# EAGLE design Telex (EAGLE 9.3.0)
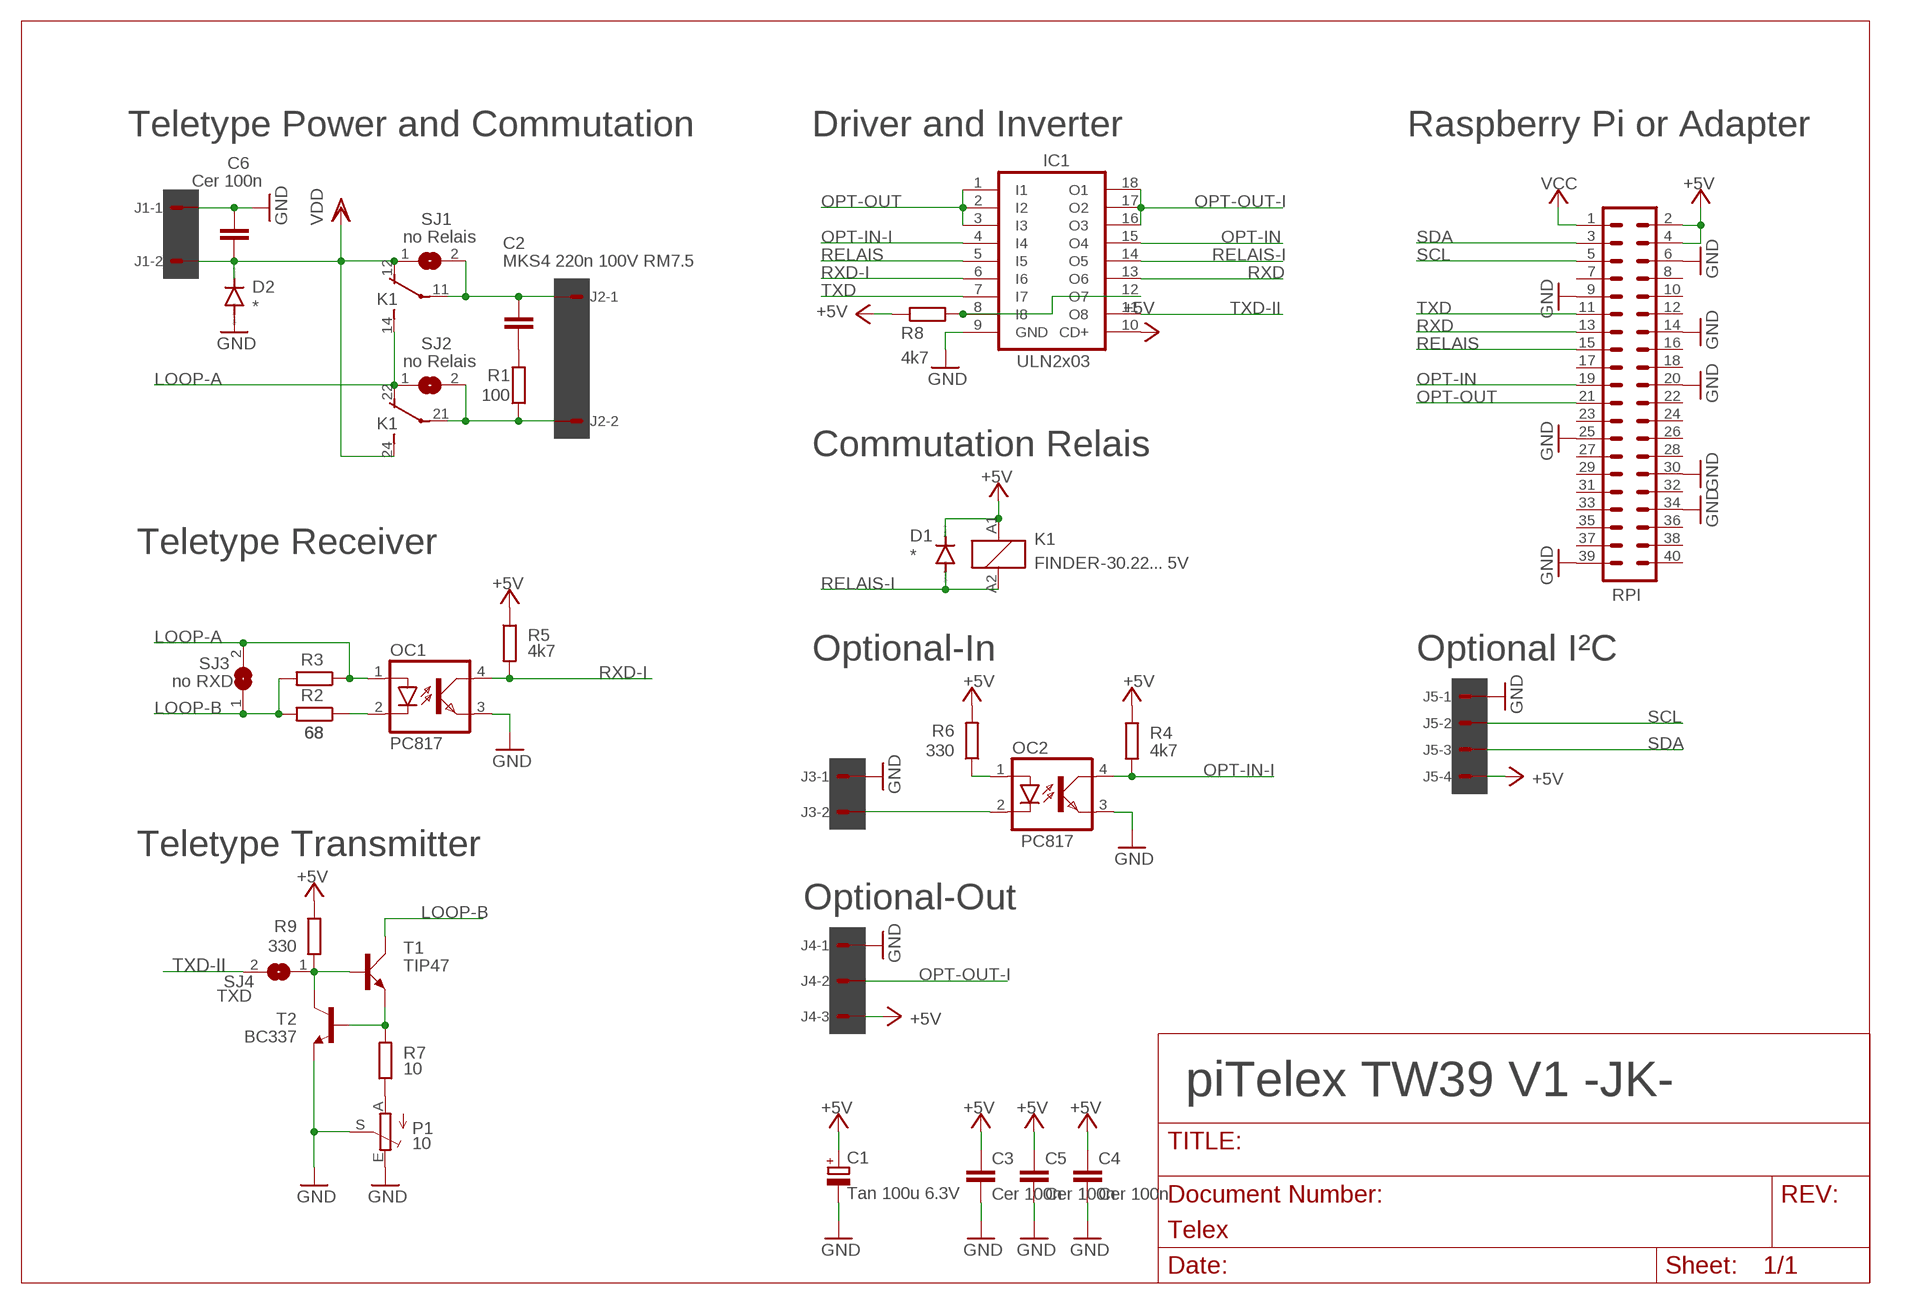
[diagram p0: schematic, sheet 1]

## Parts
C1  Tan 100u 6.3V  CPOL-EUE2.5-6  [E2,5-6]
C2  MKS4 220n 100V RM7.5  C-EU075-042X103  [C075-042X103]
C3  Cer 100n  C-EU050-024X044  [C050-024X044]
C4  Cer 100n  C-EU050-024X044  [C050-024X044]
C5  Cer 100n  C-EU050-024X044  [C050-024X044]
C6  Cer 100n  C-EU050-024X044  [C050-024X044]
D1  *  DIODE-MINIMELF  [MINIMELF]
D2  *  DIODE-MINIMELF  [MINIMELF]
IC1  ULN2x03  ULN2803A  [DIL18]
J1  22-27-2021-02  [6410-02]
J2  22-27-2021-02  [6410-02]
J3  22-27-2021-02  [6410-02]
J4  22-27-2031-03  [6410-03]
J5  22-27-2041-04  [6410-04]
K1  FINDER-30.22... 5V  FINDER-30.22  [FINDER-30.22]
OC1  PC817  [DIL04]
OC2  PC817  [DIL04]
P1  10  TRIM_EU-S64Y  [S64Y]
R1  100  R-EU_0204/7  [0204/7]
R2  68  R-EU_0204/7  [0204/7]
R3  68  R-EU_0204/7  [0204/7]
R4  4k7  R-EU_0204/7  [0204/7]
R5  4k7  R-EU_0204/7  [0204/7]
R6  330  R-EU_0204/7  [0204/7]
R7  10  R-EU_0204/7  [0204/7]
R8  4k7  R-EU_0204/7  [0204/7]
R9  330  R-EU_0204/7  [0204/7]
RPI  MA20-2  [MA20-2]
SJ1  no Relais  SJ  [SJ]
SJ2  no Relais  SJ  [SJ]
SJ3  no RXD  SJ  [SJ]
SJ4  TXD  SJ  [SJ]
T1  TIP47  TIP41C  [TO220AV]
T2  BC337  [TO92]

## Nets
+5V: C1.+ C3.1 C4.1 C5.1 D1.C IC1.10(CD+) J4.3 J5.4 K1.A1 R4.1 R5.1 R6.2 R8.1 R9.1 RPI.2 RPI.4
GND: C1.- C3.2 C4.2 C5.2 C6.2 D2.A IC1.9(GND) J1.1 J3.1 J4.1 J5.1 OC1.3(EMIT) OC2.3(EMIT) P1.E P1.S RPI.6 RPI.9 RPI.14 RPI.20 RPI.25 RPI.30 RPI.34 RPI.39 T2.1(E)
LOOP-A [60V]: K1.14(-1:S) K1.22(-2:O) OC1.1(A) R3.1 SJ2.1 SJ3.2
LOOP-B [60V]: R2.2 R3.2 SJ3.1 T1.C
N$1: C2.2 R1.2
N$2 [60V]: OC1.2(C) R2.1
N$3: OC2.1(A) R6.1
N$4 [60V]: C2.1 J2.1 K1.11(-1:P) SJ1.2
N$5: P1.A R7.1
N$6 [60V]: J2.2 K1.21(-2:P) R1.1 SJ2.2
N$10: J3.2 OC2.2(C)
N$11: R7.2 T1.E T2.2(B)
OPT-IN: IC1.15(O4) RPI.19
OPT-IN-I: IC1.4(I4) OC2.4(COL) R4.2
OPT-OUT: IC1.1(I1) IC1.2(I2) IC1.3(I3) RPI.21
OPT-OUT-I: IC1.16(O3) IC1.17(O2) IC1.18(O1) J4.2
RELAIS: IC1.5(I5) RPI.15
RELAIS-I: D1.A IC1.14(O5) K1.A2
RXD: IC1.13(O6) RPI.13
RXD-I: IC1.6(I6) OC1.4(COL) R5.2
SCL: J5.2 RPI.5
SDA: J5.3 RPI.3
TXD: IC1.7(I7) RPI.11
TXD-II: IC1.11(O8) SJ4.2
TXD-IIX: R9.2 SJ4.1 T1.B T2.3(C)
TXT-I: IC1.8(I8) IC1.12(O7) R8.2
VCC: RPI.1
VDD [60V]: C6.1 D2.C J1.2 K1.12(-1:O) K1.24(-2:S) SJ1.1
Unconnected: RPI.7 RPI.8 RPI.10 RPI.12 RPI.16 RPI.17 RPI.18 RPI.22 RPI.23 RPI.24 RPI.26 RPI.27 RPI.28 RPI.29 RPI.31 RPI.32 RPI.33 RPI.35 RPI.36 RPI.37 RPI.38 RPI.40

## Notes on the sheet
- Teletype Power and Commutation | Driver and Inverter | Raspberry Pi or Adapter
- Commutation Relais
- Teletype Receiver
- Optional-In | Optional I²C
- Teletype Transmitter
- Optional-Out
- piTelex TW39 V1 -JK-

## Library data of the parts
C1 = resistor:CPOL-EU: POLARIZED CAPACITOR, European symbol
C2-C6 = resistor:C-EU: CAPACITOR, European symbol
D1 D2 = diode:DIODE-: DIODE
IC1 = uln-udn:ULN2803A: DRIVER ARRAY
J1-J3 = con-molex:22-?-02: CONNECTOR wire to board 2.54 mm (.1 inch) pitch header; MF: MOLEX; OC_FARNELL: unknown; OC_NEWARK: unknown
J4 = con-molex:22-?-03: CONNECTOR wire to board 2.54 mm (.1 inch) pitch header; MF: MOLEX; OC_FARNELL: unknown; OC_NEWARK: unknown
J5 = con-molex:22-?-04: CONNECTOR wire to board 2.54 mm (.1 inch) pitch header; MF: MOLEX; OC_FARNELL: unknown; OC_NEWARK: unknown
K1 = relay:FINDER-30.22: SUBMINIATURE DIL-RELAIS FINDER 30.22.9.024.0000 Kontakt max. AC - 125V Distributor: Farnell Bestell Nr.: 1217371 Source: http://www.farnell.com/datasheets/87634.pdf; OC_FARNELL: unknown; OC_NEWARK: unknown
OC1 OC2 = optocoupler:PC817: SHARP OPTO COUPLER; MPN: PC817X4J000F; OC_FARNELL: 9707727; OC_NEWARK: 97K7059
P1 = pot:TRIM_EU-: POTENTIOMETER
R1-R9 = resistor:R-EU_: RESISTOR, European symbol
RPI = con-lstb:MA20-2: PIN HEADER; OC_FARNELL: unknown; OC_NEWARK: unknown
SJ1-SJ4 = jumper:SJ: SMD solder JUMPER
T1 = transistor-power:TIP41C: NPN TRANSISTOR
T2 = transistor:BC337: NPN TRANSISTOR

## Net classes
1 60V: width 0.305 mm, clearance 0.305 mm

## Board
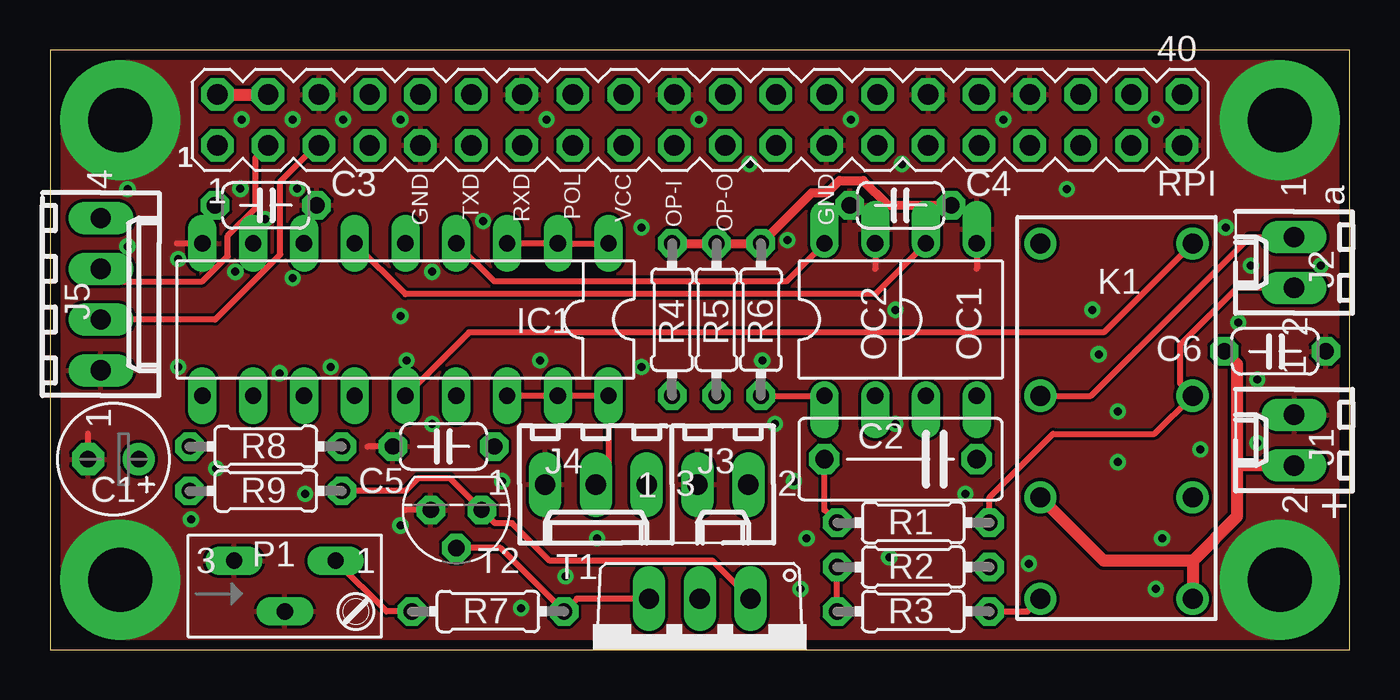
[diagram p1: board, top side]
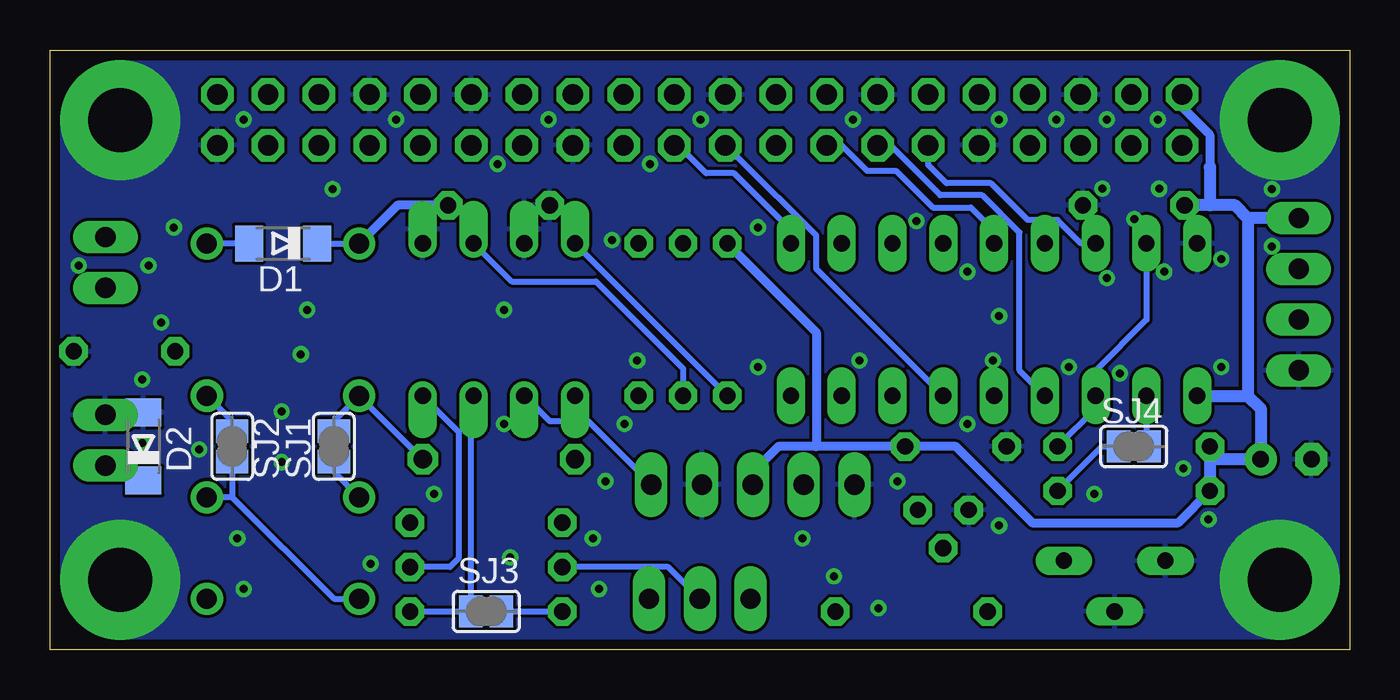
[diagram p2: board, bottom side, seen from below]

Size 65 x 30 mm. Coordinates in mm from the lower left corner, seen from the top.
Outline: 0,0 65,0 65,30 0,30 0,0
Copper layers (1*16): Top 0.035mm / dielectric 1.5mm / Bottom 0.035mm
Design rules "default *": minimum track width 12mil, minimum drill 0.3mm, track to track 6mil, track to pad 6mil, pad to pad 6mil, via to via 6mil, smd to smd 6mil, copper to edge 0.5mm, drill to drill 6mil, minimum pad ring 12mil, minimum via ring 8mil, stop-mask expansion 4mil, vias tented up to drill 0.45mm, thermal gap 6mil

### Footprints (pad centres in the part's own frame; a part is rotated, then mirrored left to right if it is on the bottom)
E2,5-6 = drill 0.813 pad 1.6: + -1.27,0 | drill 0.813 pad 1.6 octagon: - 1.27,0
C075-042X103 = drill 0.914 octagon: 1 -3.81,0; 2 3.81,0
C050-024X044 = drill 0.813 octagon: 1 -2.54,0; 2 2.54,0
MINIMELF = smd 1.4 x 1.8: A 1.7,0; C -1.7,0
DIL18 = drill 0.813 long: 1 -10.16,-3.81; 2 -7.62,-3.81; 3 -5.08,-3.81; 4 -2.54,-3.81; 5 0,-3.81; 6 2.54,-3.81; 7 5.08,-3.81; 8 7.62,-3.81; 9 10.16,-3.81; 10 10.16,3.81; 11 7.62,3.81; 12 5.08,3.81; 13 2.54,3.81; 14 0,3.81; 15 -2.54,3.81; 16 -5.08,3.81; 17 -7.62,3.81; 18 -10.16,3.81
6410-02 = drill 1.016 long: 1 1.27,0; 2 -1.27,0
6410-03 = drill 1.016 long: 1 2.54,0; 2 0,0; 3 -2.54,0
6410-04 = drill 1.016 long: 1 3.81,0; 2 1.27,0; 3 -1.27,0; 4 -3.81,0
FINDER-30.22 = drill 1 pad 1.6: 11 -1.27,-3.81; 12 3.81,-3.81; 14 8.89,-3.81; 21 -1.27,3.81; 22 3.81,3.81; 24 8.89,3.81; A1 -8.89,-3.81; A2 -8.89,3.81
DIL04 = drill 0.813 offset: 1 -1.27,-3.81; 2 1.27,-3.81; 3 1.27,3.81; 4 -1.27,3.81
S64Y = drill 0.813 long: A 2.54,1.27; E -2.54,1.27; S 0,-1.27
0204/7 = drill 0.813 octagon: 1 -3.81,0; 2 3.81,0
MA20-2 = drill 1.016 octagon: 1 -24.13,-1.27; 2 -24.13,1.27; 3 -21.59,-1.27; 4 -21.59,1.27; 5 -19.05,-1.27; 6 -19.05,1.27; 7 -16.51,-1.27; 8 -16.51,1.27; 9 -13.97,-1.27; 10 -13.97,1.27; 11 -11.43,-1.27; 12 -11.43,1.27; 13 -8.89,-1.27; 14 -8.89,1.27; 15 -6.35,-1.27; 16 -6.35,1.27; 17 -3.81,-1.27; 18 -3.81,1.27; 19 -1.27,-1.27; 20 -1.27,1.27; 21 1.27,-1.27; 22 1.27,1.27; 23 3.81,-1.27; 24 3.81,1.27; 25 6.35,-1.27; 26 6.35,1.27; 27 8.89,-1.27; 28 8.89,1.27; 29 11.43,-1.27; 30 11.43,1.27; 31 13.97,-1.27; 32 13.97,1.27; 33 16.51,-1.27; 34 16.51,1.27; 35 19.05,-1.27; 36 19.05,1.27; 37 21.59,-1.27; 38 21.59,1.27; 39 24.13,-1.27; 40 24.13,1.27
SJ = smd 1.168 x 1.6: 1 -0.762,0; 2 0.762,0
TO220AV = drill 1.016 long: B -2.54,-2.54; C 0,-2.54; E 2.54,-2.54
TO92 = drill 0.813 octagon: 1 1.27,0; 2 0,1.905; 3 -1.27,0

### Placement (x,y rotation side)
C1  3.17,9.53 180 top
C2  42.55,9.53 180 top
C3  10.79,22.23 0 top
C4  42.55,22.23 180 top
C5  19.68,10.16 180 top
C6  61.28,14.92 0 top
D1  53.34,20.32 180 bottom
D2  60.33,10.16 90 bottom
IC1  17.78,16.51 180 top
J1  62.23,10.48 90 top
J2  62.23,19.37 90 top
J3  33.66,8.26 180 top
J4  27.3,8.26 180 top
J5  2.54,17.78 270 top
K1  53.34,11.43 270 top
OC1  45.09,16.51 0 top
OC2  40.01,16.51 0 top
P1  11.75,3.17 0 top
R1  43.18,6.35 180 top
R2  43.18,4.13 180 top
R3  43.18,1.91 180 top
R4  31.11,16.51 270 top
R5  33.34,16.51 270 top
R6  35.56,16.51 90 top
R7  21.91,1.91 0 top
R8  10.79,10.16 0 top
R9  10.79,7.94 0 top
RPI  32.5,26.5 0 top
SJ1  50.8,10.16 90 bottom
SJ2  55.88,10.16 90 bottom
SJ3  43.18,1.91 180 bottom
SJ4  10.79,10.16 0 bottom
T1  32.5,0 180 top
T2  20.32,6.99 180 top

### Tracks (layer width: path | path; a pad name or v marks a point on that pad's centre or on a via)
+5V
  Top 0.457: R4.1 R5.1 R6.2 38.1,22.86 38.88,22.86 39.49,23.47 40.66,23.47 41.91,22.23 C4.1
  Top 0.61: RPI.2 RPI.4
  Bottom 0.305: D1.C K1.A1
  Bottom 0.457: 26.67,10.16 C5.1 19.68,10.16 15.88,6.35 8.57,6.35 R9.1 | 26.67,10.16 28.57,10.16 29.84,8.89 J4.3 | C4.1 47.62,22.23 K1.A1 | RPI.2 8.37,27.13 7,25.76 7,24.13 | 26.67,10.16 26.67,15.88 R4.1
  Bottom 0.61: 7,24.13 6.99,24.14 6.99,22.23 C3.1 5.71,22.23 5.08,21.59 | 5.08,12.7 4.45,12.06 C1.+ 6.99,9.53 | 5.08,21.59 5.08,12.7 | 6.99,9.53 R8.1 | 6.99,9.53 R9.1 | IC1.10 5.08,12.7 | J5.4 5.08,21.59
GND  (via drill 0.4 pad 0.6, 3.2 pad 6)
  Top 0.305: J3.1 32.38,9.53 | J4.1 24.77,9.53 | OC2.3 41.27,19.05 | OC1.3 46.35,19.05 | C1.- 1.91,10.79 | IC1.9 6.35,20.32 | T2.1 17.78,6.99 | C5.2 15.88,10.16
  Bottom 0.305: D2.A 62.12,11.86 J1.1
  other vias: 61.5,26.5 3.5,3.5 3.5,26.5 61.5,3.5 50.87,23.03 36.9,20.49 29.59,21.12 21.66,21.44 19.12,18.9 17.53,16.68 24.51,14.46 29.59,14.14 35.63,14.46 53.41,11.92 53.41,9.38 57.53,10.01 59.44,16.36 60.07,19.22 58.8,21.12 52.14,17 52.45,14.77 55.63,5.57 55.31,3.03 48.96,4.3 41.98,4.61 42.29,11.28 36.26,11.28 37.21,8.42 37.53,3.03 37.85,5.57 23.56,2.07 27.37,5.57 22.61,8.42 17.53,6.2 19.12,11.28 17.85,14.46 14.04,14.14 12.77,7.79 6.42,14.14 12.13,18.58 8.32,9.06 7.05,6.52 3.88,20.17 3.88,23.03 12.13,26.52 9.59,26.52 42.29,17 60.39,10.33 60.39,13.5 63.57,19.22 34.99,24.3 42.61,24.3 12.35,23.07 9.52,23.05 6.42,19.54 45.79,7.79 55.31,26.52 47.69,26.52 40.07,26.52 32.45,26.52 24.83,26.52 17.53,26.52 14.67,26.52 9.27,18.9 25.78,3.66 11.5,13.82 10.77,21.54
  pour Top: 0.5,3.5 0.5,26.5 3.5,29.5 61.5,29.5 64.5,26.5 64.5,3.5 61.5,0.5 3.5,0.5
  pour Bottom: 0.5,3.5 0.5,26.5 3.5,29.5 61.5,29.5 64.5,26.5 64.5,3.5 61.5,0.5 3.5,0.5
LOOP-A
  Top 0.305: R3.1 48.9,1.91 K1.14
  Bottom 0.305: R3.1 SJ3.2 43.94,12.57 OC1.1 | SJ2.1 55.88,7.62 | 55.88,7.62 K1.22 | 55.88,7.62 50.8,2.54 K1.14
LOOP-B
  Top 0.305: R3.2 R2.2
  Bottom 0.305: T1.C 34.09,4.13 R2.2 | SJ3.1 R3.2
N$1
  Top 0.305: R1.2 38.73,6.99 C2.2
N$2
  Bottom 0.305: R2.1 44.99,4.13 44.55,4.57 44.55,10.9 OC1.2
N$3
  Top 0.305: R6.1 OC2.1
N$4
  Top 0.305: K1.11 52.07,12.7 60.01,20.64 J2.1
  Bottom 0.305: C2.1 K1.11 50.8,11.43 SJ1.2
N$5
  Top 0.305: R7.1 16.83,1.91 P1.A
N$6
  Top 0.305: J2.2 59.37,18.1 56.52,15.24 56.52,13.34 K1.21 55.24,10.79 50.16,10.79 46.99,7.62 R1.1
  Bottom 0.305: SJ2.2 55.88,11.43 K1.21
N$10
  Bottom 0.305: OC2.2 40.01,11.43 38.1,11.43 J3.2
N$11
  Top 0.305: T2.2 22.54,5.08 R7.2 26.35,2.54 T1.E
OPT-IN
  Bottom 0.305: IC1.15 26.67,19.05 26.67,20.7 30.59,24.62 30.62,24.62 RPI.19
OPT-IN-I
  Top 0.305: OC2.4 36.83,18.41 22.23,18.41 IC1.4
  Bottom 0.305: OC2.4 R4.2
OPT-OUT
  Top 0.305: IC1.1 IC1.2 IC1.3
  Bottom 0.305: IC1.1 27.94,20.98 30.79,23.82 32.18,23.82 33.59,25.23 RPI.21
OPT-OUT-I
  Top 0.305: J4.2 27.94,8.89 IC1.18 IC1.17 IC1.16
RELAIS
  Bottom 0.305: IC1.5 17.78,20.95 18.94,22.12 20.85,22.12 22.69,23.96 24.14,23.96 25.41,25.23 RPI.15
RELAIS-I
  Top 0.305: K1.A2 52.7,15.88 20.95,15.88 IC1.14
  Bottom 0.305: D1.A K1.A2
RXD
  Bottom 0.305: RPI.13 22.98,25.23 20.47,22.73 18.37,22.73 16.51,20.86 16.51,13.97 IC1.13
RXD-I
  Top 0.305: OC1.4 41.27,17.78 17.78,17.78 IC1.6
  Bottom 0.305: R5.2 33.34,14.06 37.69,18.41 41.91,18.41 OC1.4
SCL
  Top 0.305: RPI.5 13.34,25.23 11.52,23.41 11.52,19.77 8.26,16.51 J5.2
SDA
  Top 0.305: J5.3 3.17,18.41 7.62,18.41 8.89,19.68 8.89,20.7 10.29,22.1 10.29,24.61 RPI.3
TXD
  Bottom 0.305: RPI.11 21.07,24.25 20.16,23.34 17.94,23.34 16.09,21.49 14.61,21.49 13.44,20.32 IC1.7
TXD-II
  Bottom 0.305: IC1.11 10.16,10.92 10.03,10.79 SJ4.2
TXD-IIX
  Top 0.305: T1.B 33.13,4.45 24.99,4.45 23.11,6.33 22.25,6.33 T2.3 20,8.57 18.41,8.57 17.78,7.94 R9.2
  Bottom 0.305: R9.2 12.38,10.16 SJ4.1
TXT-I
  Bottom 0.305: IC1.8 10.16,16.51 12.7,13.97 IC1.12 12.7,12.06 R8.2
VDD
  Top 0.61: J1.2 59.37,9.21 | 59.37,9.21 59.37,6.67 57.15,4.45 | 57.15,4.45 K1.24 | 57.15,4.45 52.7,4.45 K1.12 | C6.1 59.37,14.29 59.37,9.21
  Bottom 0.305: J1.2 61.07,9.21 D2.C | SJ1.1 50.8,8.89 K1.12

### Text on the board
tNames: 1 | GND | TXD | RXD | POL | VCC | OP-O | GND | OP-I | a | +
bStop: pyTelex TW39 V1 | -JK-